# Altium schematic sheet PCU_SCH.SchDoc
size A; SheetNumber: 2; SheetTotal: 9; SPICEModelCacheEUDXTYFM: <root> / <DocumentId>EUDXTYFM</DocumentId> / <CacheFrame Number="0"> / <Model Name="jmk325b7476_mhpr" Kind="CKT"> / <Text>* JMK325B7476_MHPR     SPICE MODEL  ( General Type ) / *-------------------------------------------------------------------------------------------------------- / * Model Generated by TAIYO YUDEN Corporation (http://www.ty-top.com) / * Version 1.0 / * TAIYO YUDEN Control No. 170508_150609 / * Copyright(c) 2015 TAIYO YUDEN CO.,LTD. All Rights Reserved. / *-------------------------------------------------------------------------------------------------------- / * / * Products Name : Multilayer Ceramic Capacitors / * / * Characteristics : / *     Capacitance : 47 uF , Rated Voltage : 6.3V , TCC : X7R / *     Case Size : 3.2 x 2.5 / 0.126 x 0.098 [mm/inch] , Thickness : 2.5 / 0.098 [mm/inch] / *     (Conditions: Temperature = 25 degC , DC Bias Current/Voltage = 0A / 0V) / * / * Frequency Range : 40Hz - 3GHz / * / * External Node Assignments : / * / *  1  o---| |---o  2 / * / *-------------------------------------------------------------------------------------------------------- / .SubCkt JMK325B7476_MHPR 1 2 / **************************** / C0 1 110 39.689u / Cm 1 101 0.5586u / C1 101 102 0.22407u / Rc1 101 102 296.71 / C2 102 103 0.51762u / Rc2 102 103 80.311 / C3 103 110 0.016501u / Rc3 103 110 10.638 / C2m 1 301 6.2201u / C21 301 302 21.102u / Rc21 301 302 141.41 / C22 302 303 9.4039u / Rc22 302 303 99.198 / C23 303 304 6.3192u / Rc23 303 304 47.493 / C24 304 305 5.792u / Rc24 304 305 24.412 / C25 305 306 2.8968u / Rc25 305 306 13.6 / C26 306 307 1.7292u / Rc26 306 307 0.78802 / C27 307 308 0.91698u / Rc27 307 308 1.4134 / C28 308 309 0.28276u / Rc28 308 309 1.2618 / C29 309 110 2544.7p / Rc29 309 110 6.1962 / Rp0 1 110 2.12765957446809Meg / L0 110 120 0.19473n / Lm 120 130 0.18939n / L1 120 121 0.19199n / RL1 121 130 0.10143 / L2 120 122 0.46215n / RL2 122 130 57.618m / L3 120 123 2.0569n / RL3 123 130 168.9 / CR 120 124 3.9311u / LR 124 125 0.94748n / RR 125 130 9.6041m / CL 130 140 2.2173p / LL 130 140 0.16025n / RL 130 140 12.556 / Rs 140 2 2.1959m / **************************** / .ends JMK325B7476_MHPR</Text> / </Model> / </CacheFrame> / </root>
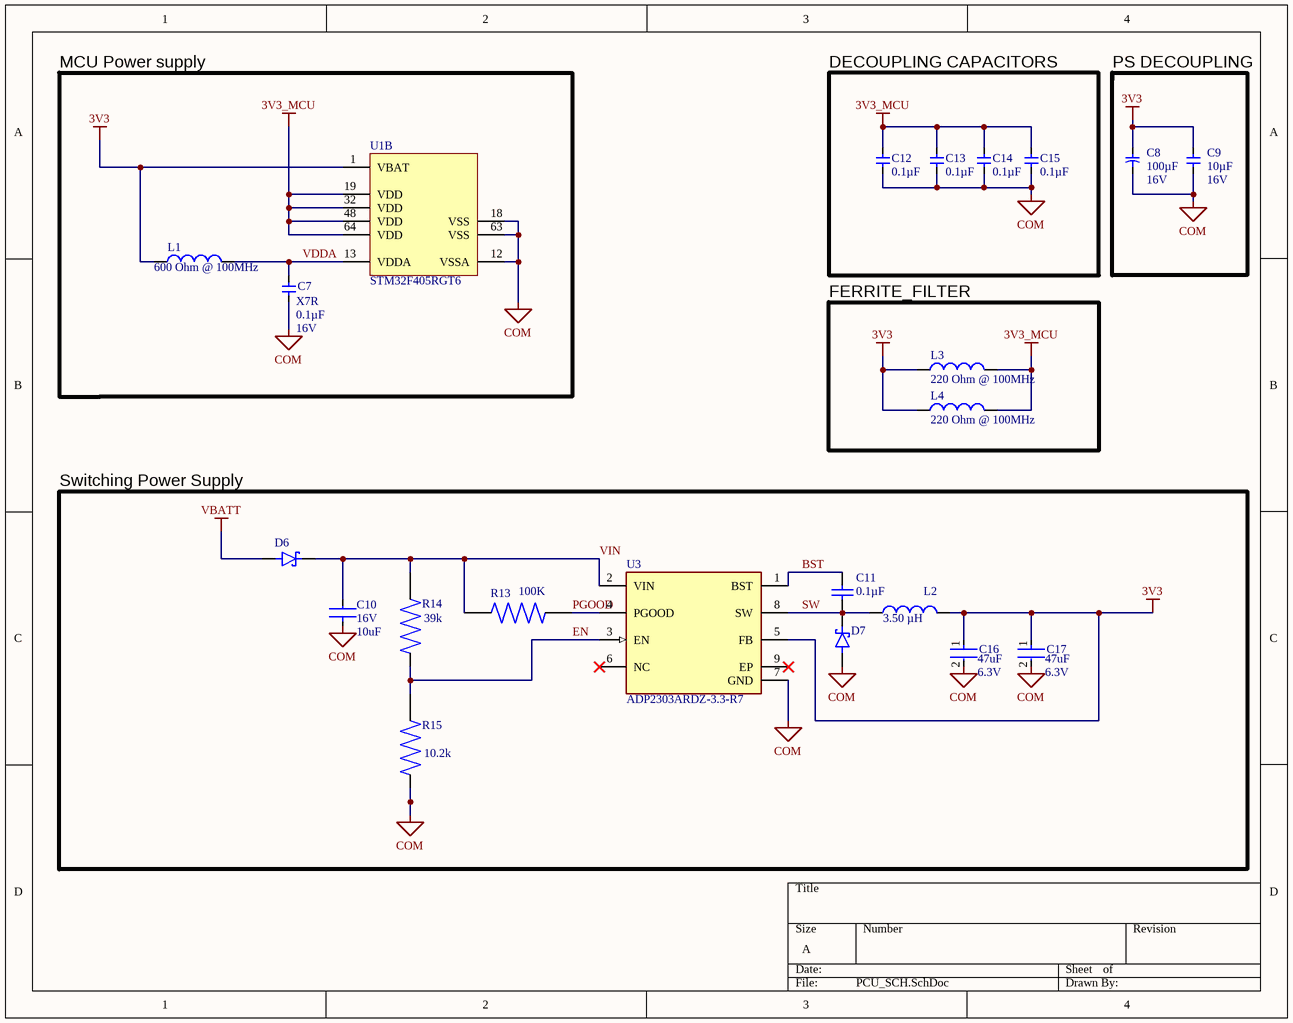
[diagram p0: PCU_SCH.SchDoc]

## Parts
C7  Temperature Coefficient: X7R  Capacitance: 0.1µF  Voltage - Rated: 16V  [C0603]  (hidden comment: GRM188R71C104KA01D)
C8  Capacitance: 100µF  Voltage Rating: 16V  [SMD J6.3]  (hidden comment: UCL1C101MCL6GS)
C9  Capacitance: 10µF  Voltage - Rated: 16V  [C0805]  (hidden comment: CL21B106KOQNNNE)
C10  Voltage Rating: 16V  Capacitance: 10uF  [C1210]  (hidden comment: GRM32ER71H106KA12L)
C11  0.1µF  [CAPC0603X33X15ML03T05]
C12  Capacitance: 0.1µF  [C0603]  (hidden comment: GRM188R71C104KA01D)
C13  Capacitance: 0.1µF  [C0603]  (hidden comment: GRM188R71C104KA01D)
C14  Capacitance: 0.1µF  [C0603]  (hidden comment: GRM188R71C104KA01D)
C15  Capacitance: 0.1µF  [C0603]  (hidden comment: GRM188R71C104KA01D)
C16  Voltage Rating: 6.3V  Capacitance: 47uF  [FP-1210-L_3_2_0_3-W_2_5_0-MFG]  (hidden comment: JMK325B7476KMHPR)
C17  Voltage Rating: 6.3V  Capacitance: 47uF  [FP-1210-L_3_2_0_3-W_2_5_0-MFG]  (hidden comment: JMK325B7476KMHPR)
D6  SK34A  [DIOM4325X250N]  (value not drawn)
D7  SK34A  [DIOM4325X250N]  (value not drawn)
L1  Impedance @ Frequency: 600 Ohm @ 100MHz  [L0603]  (hidden comment: MMZ1608B601C)
L2  Inductance: 3.50 µH  [WE-HCI-1890]  (hidden comment: 7443556350)
L3  Impedance @ Frequency: 220 Ohm @ 100MHz  [L0805]  (hidden comment: BLM21PG221SN1D)
L4  Impedance @ Frequency: 220 Ohm @ 100MHz  [L0805]  (hidden comment: BLM21PG221SN1D)
R13  value 100K  [RES_ERJU03J104V]  (hidden comment: ERJU03J104V)
R14  value 39k  [RESC1608X55N]  (hidden comment: ERJ-3GEYJ393V)
R15  value 10.2k  [RES_ERJ3EKF1022V]  (hidden comment: ERJ3EKF1022V)
U1  STM32F405RGT6  [STM-LQFP64_M]  (part B of 2)
U3  ADP2303ARDZ-3.3-R7  [FP-RD-8-1-IPC_A]

## Blocks framed on the sheet
MCU Power supply: C7 L1 U1
DECOUPLING CAPACITORS: C12-C15
PS DECOUPLING: C8 C9
FERRITE_FILTER: L3 L4
Switching Power Supply: C10 C11 C16 C17 D6 D7 L2 R13-R15 U3

## Nets
3V3: C8.A C9.2 C16.1 C17.1 L1.1 L2.2 L3.1 L4.1 U1.1(VBAT) U3.5(FB)
3V3_MCU: C12.1 C13.1 C14.1 C15.1 L3.2 L4.2 U1.19(VDD) U1.32(VDD) U1.48(VDD) U1.64(VDD)
COM: C7.1 C8.K C9.1 C10.1 C12.2 C13.2 C14.2 C15.2 C16.2 C17.2 D7.A R15.1 U1.12(VSSA) U1.18(VSS) U1.63(VSS) U3.7(GND)
VBATT: D6.A
BST: C11.2 U3.1(BST)
EN: R14.1 R15.2 U3.3(EN)
PGOOD: R13.2 U3.4(PGOOD)
SW: C11.1 D7.C(K) L2.1 U3.8(SW)
VDDA: C7.2 L1.2 U1.13(VDDA)
VIN: C10.2 D6.C(K) R13.1 R14.2 U3.2(VIN)

Not connected (* = marked no-connect by the designer): U3 6(NC)* 9(EP)*

## Notes on the sheet
- Mettre le cap le plus proche de la pin VIN

## Library data of the parts
C7 C12-C15 = GRM188R71C104KA01D: CAP CER 0.1UF 16V 10% X7R 0603; ComponentLink1Description: Datasheet; ComponentLink1URL: http://search.murata.co.jp/Ceramy/image/img/A01X/G101/ENG/GRM188R71C104KA01-01.pdf; ComponentLink2URL: http://media.digikey.com/photos/Murata%20Photos/0603%20Murata%20MLCC%20Caps.jpg; ComponentLink2Description: Photo; Pricing 1: 1=0.13 (USD); Tolerance: ±10%; Operating Temperature: -55°C ~ 125°C; Applications: General Purpose; Supplier 1: Digi-Key; Supplier Part Number 1: 490-1532-1-ND
  C12-C15: Temperature Coefficient: X7R; Voltage - Rated: 16V
C8 = UCL1C101MCL6GS: CAP ALUM 100UF 16V 20% SMD; Ripple Current: 600mA; Impedance: 160 mOhm; ComponentLink1Description: Datasheet; ComponentLink1URL: http://nichicon-us.com/english/products/pdfs/e-cl.pdf; ComponentLink2Description: Photo; Pricing 1: 1=0.45, 10=0.306, 100=0.144, 250=0.1026, 500=0.0783, 1000=0.054 (USD); Tolerance: ±20%; Operating Temperature: -55°C ~ 105°C; Supplier 1: Digi-Key; Supplier Part Number 1: 493-3920-1-ND
C9 = CL21B106KOQNNNE: CAP CER 10UF 16V 10% X7R 0805; ComponentLink1Description: Datasheet; ComponentLink1URL: http://www.samsungsem.com/kr/front/downloadcms.do?path=/kr/support/product-search/mlcc/__icsFiles/afieldfile/2014/11/05&fileName=C_CL21B106KOQNNNE.pdf; ComponentLink2URL: http://media.digikey.com/Renders/Samsung%20Electro-Mechanics%20America/CL%20Series%201206(3216%20Metric)%2014.jpg; ComponentLink2Description: Photo; Pricing 1: 1=0.39 (USD); Tolerance: ±10%; Temperature Coefficient: X7R; Operating Temperature: -55°C ~ 125°C; Applications: General Purpose; Supplier 1: Digi-Key; Supplier Part Number 1: 1276-2872-1-ND
C10 = CMP-2000-06106-2: CAP CER 10UF 16V X7R 0805; Manufacturer Part Number: CL21B106KOQNNNE; Manufacturer: Samsung Electro-Mechanics America, Inc; Material: Ceramic; Tolerance: 10%; Temperature Coefficient: 15%; Digikey Description: CAP CER 10UF 16V X7R 0805; Lead Free: Yes; ComponentLink2URL: http://www.samsungsem.com/servlet/FileDownload?path=productsearch&sname=CL21B106KOQNNNE.pdf&oname=CL21B106KOQNNNE.pdf; ComponentLink2Description: Datasheet; Temperature Range Low: -55°C; RoHS: TRUE; Category: Cap; Temperature Characteristic: X7R; Automotive: No; Octopart: https://octopart.com/cl21b106koqnnne-samsung-19832289; Device Class L3: Ceramic Capacitors; Temperature Range High: +125°C; Height: 1.4mm; Device Class L2: Capacitors; Value: 10uF; Temperature: -55°C to +125°C; Device Class L1: Passive Components; Ipc Land Pattern Name: CAPC200125X125; Package: CL21B106KOQNNNE
C11 = CMP-2010-01734-1: MC000311; Manufacturer: Multicomp; Part Number: MC000311
C16 = CMP-14477-003362-2: CAP CER 47UF 6.3V X7R 1210; Tolerance: 10%; Case/Package: 1210; Packaging: Cut Tape; Mount: Surface Mount; Case Code (Imperial): 1210; Max Operating Temperature: 125°C; Min Operating Temperature: -55°C; RoHS Compliant: Yes; Ratings: AEC-Q200; Case Code (Metric): 3225
C17 = CMP-14477-003362-2: None; Tolerance: 10%; Case/Package: 1210; Packaging: Cut Tape; Mount: Surface Mount; Case Code (Imperial): 1210; Max Operating Temperature: 125°C; Min Operating Temperature: -55°C; RoHS Compliant: Yes; Ratings: AEC-Q200; Case Code (Metric): 3225
L1 = MMZ1608B601C: FERRITE CHIP 600 OHM 500MA 0603; DC Resistance (DCR): 400 mOhm Max; Filter Type: Differential Mode - Single; Current Rating: 500mA; ComponentLink1URL: http://product.tdk.com/en/catalog/datasheets/beads_commercial_signal_mmz_en.pdf; ComponentLink1Description: datasheet; ComponentLink2URL: http://media.digikey.com/Renders/TDK%20Renders/MMZ1608xxxxxTAH0.jpg; ComponentLink2Description: photo; Supplier 1: Digi-Key; Supplier Part Number 1: 445-2166-1-ND
L2 = CMP-0226-00011-1: SMD Flat Wire High Current Inductor WE-HCI, L=3.50 µH; ComponentLink1URL: http://www.we-online.com; ComponentLink2Description: Datasheet; PackageVersion: 2009; PackageReference: WE-HCI-1890; ComponentLink2URL: http://www.we-online.de/katalog/media/pdf/7443556350.pdf; PackageDescription: Inductor, 2-Leads, Body 18.3 x 18.2 mm; DatasheetVersion: ver 3, Nov-2009; ComponentLink1Description: Manufacturer Link
L3 L4 = BLM21PG221SN1D: FERRITE CHIP 220 OHM 0805; Current Rating: 2A; DC Resistance (DCR): 45 mOhm Max; Filter Type: Differential Mode - Single; Supplier 1: Digi-Key; Supplier Part Number 1: 490-1054-1-ND; ComponentLink1URL: http://search.murata.co.jp/Ceramy/image/img/PDF/ENG/L0110S0100BLM21P.pdf; ComponentLink1Description: datasheet; ComponentLink2URL: http://media.digikey.com/photos/Murata%20Photos/BLM21%20SERIES%200805.jpg; ComponentLink2Description: photo
R13 = ERJU03J104V: RES 100K OHM 5% 1/10W 0603 SMD; Package: None; Price: None; Availability: Unavailable; MP: ERJU03J104V
R14 = ERJ-3GEYJ393V: Res Thick Film 0603 39K Ohm 5% 0.1W(1/10W) ?200ppm/?C Molded SMD Automotive T/R; Package: None; Price: None; MP: ERJ-3GEYJ393V; Availability: Unavailable
R15 = ERJ3EKF1022V: RES SMD 10.2K OHM 1% 1/10W 0603; Price: None; Availability: Unavailable; MP: ERJ3EKF1022V; Package: None
U1 = CMP-0243-00019-3: ARM Cortex-M4 32-bit MCU+FPU, 210 DMIPS, 1024 kB Flash, 192 kB Internal RAM, 51 I/Os, 64-pin LQFP, -40 to 85 degC, Tray; Manufacturer: STMicroelectronics; Supply Voltage(Vcc) min (V): 1.8; Supply Voltage(Vcc) max (V): 3.6; Internal RAM Size (kB): 192; I/Os (High Current): 51; D/A Converter: 2x12-bit; FLASH Size (Prog) (kB): 1024; Operating Frequency(F) (Processor speed) (MHz): 168; ComponentLink2Description: Datasheet; PackageVersion: Rev. 4, 06/2013; DatasheetVersion: Rev. 4; Core: ARM Cortex-M4; ComponentLink2URL: http://www.st.com/st-web-ui/static/active/en/resource/technical/document/datasheet/DM00037051.pdf; PackageReference: LQFP64; Packing: Tray; ComponentLink1Description: Manufacturer URL; ComponentLink3URL: http://www.st.com/st-web-ui/static/active/en/resource/technical/document/datasheet/DM00037051.pdf; ComponentLink3Description: Package Specification; Mounting Technology: Surface Mount; ComponentLink1URL: http://www.st.com/web/en/home.html; PackageDescription: 64-Pin Low Profile Quad Flat Package, 10 x 10 mm Body, 0.5 mm Pitch; PartNumber: STM32F405RGT6
U3 = CMP-09139-000634-1: IC REG BUCK 3.3V 3A 8SOIC; Operating Supply Current: 950uA; Synchronous Rectifier: No; Min Output Voltage: 800mV; Fall Time: 280ns; Output Type: Fixed; Operating Supply Voltage: 20V; Rise Time: 170ns; Output Configuration: Positive; Number of Outputs: 1; Min Input Voltage: 3V; Max Output Voltage: 16V; Switching Frequency: 700kHz; Max Duty Cycle: 50%; Series: -; Number of Pins: 8; Packaging: Tape and Reel; Mount: Surface Mount; Lead Free: Contains Lead; Min Operating Temperature: -40°C; RoHS Compliant: Yes; Radiation Hardening: No; Width: 4mm; Nominal Output Voltage: 3.3V; Contact Plating: Tin; Height: 1.75mm; Case/Package: SOIC; Max Output Current: 3A; Max Operating Temperature: 125°C; Length: 4.9mm; Max Input Voltage: 20V; Output Voltage: 3.3V; Output Current: 3A; Nominal Supply Current: 950uA; Weight: 0.019048oz
D6 D7 = SK34A: Price: None; Availability: Unavailable; Value: *; MP: SK34A; Package: None